# EAGLE design Seilwinde (EAGLE 6.6.0)
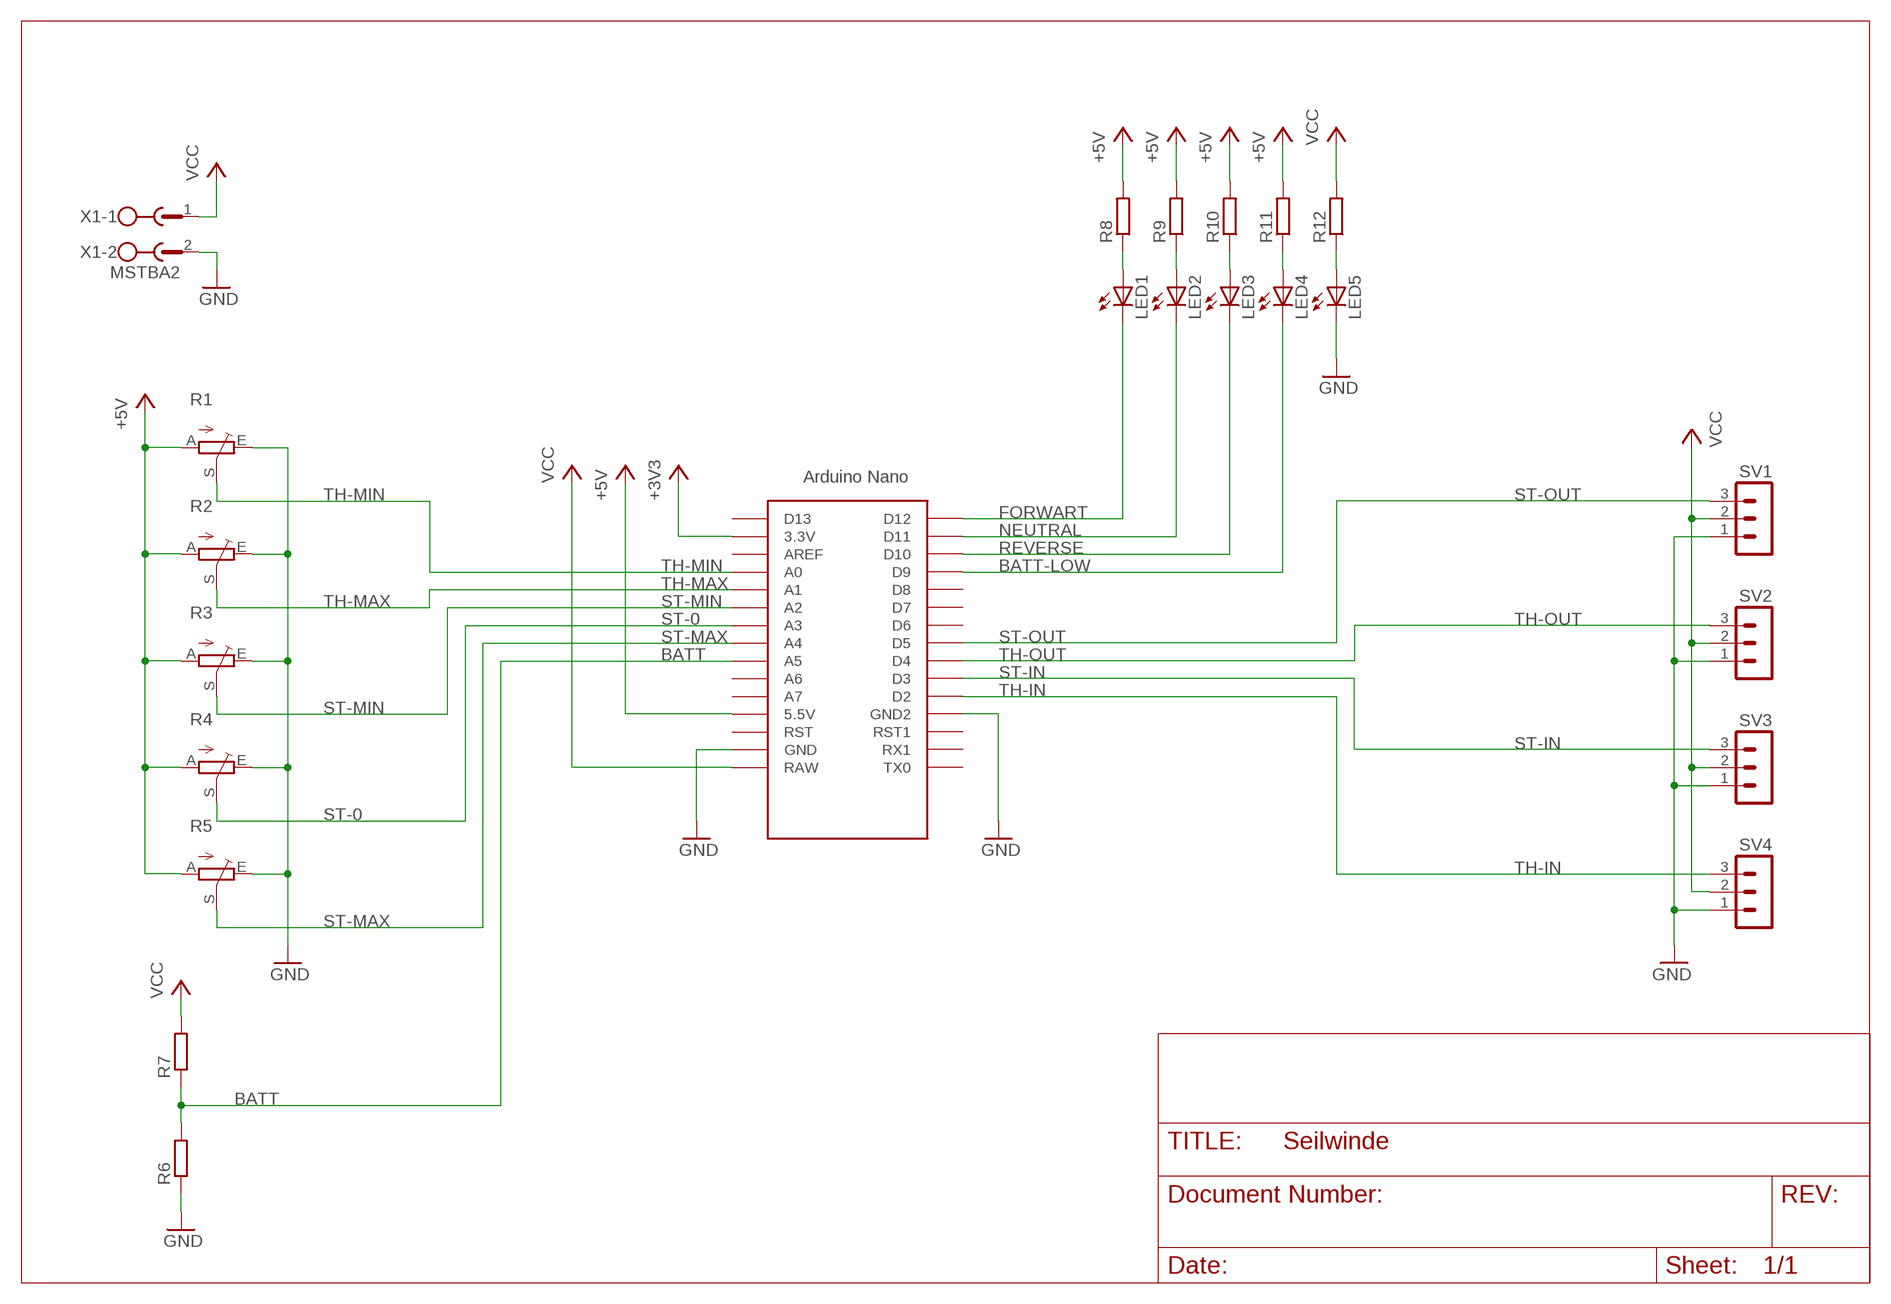
[diagram p0: schematic, sheet 1]

## Parts
LED1  LEDCHIPLED_1206  [CHIPLED_1206]
LED2  LEDCHIPLED_1206  [CHIPLED_1206]
LED3  LEDCHIPLED_1206  [CHIPLED_1206]
LED4  LEDCHIPLED_1206  [CHIPLED_1206]
LED5  LEDCHIPLED_1206  [CHIPLED_1206]
R1  TRIM_EU-S64W  [S64W]
R2  TRIM_EU-S64W  [S64W]
R3  TRIM_EU-S64W  [S64W]
R4  TRIM_EU-S64W  [S64W]
R5  TRIM_EU-S64W  [S64W]
R6  R-EU_R1206  [R1206]
R7  R-EU_R1206  [R1206]
R8  R-EU_R1206  [R1206]
R9  R-EU_R1206  [R1206]
R10  R-EU_R1206  [R1206]
R11  R-EU_R1206  [R1206]
R12  R-EU_R1206  [R1206]
SV1  MA03-1  [MA03-1]
SV2  MA03-1  [MA03-1]
SV3  MA03-1  [MA03-1]
SV4  MA03-1  [MA03-1]
U$1  NANO  [NANO]
X1  MSTBA2  [MSTBA2]

## Nets
+3V3: U$1.3.3V
+5V: R1.A R2.A R3.A R4.A R5.A R8.2 R9.2 R10.2 R11.2 U$1.5V(5.5V)
BATT: R6.2 R7.1 U$1.A5
BATT-LOW: LED4.C U$1.D9
FORWART: LED1.C U$1.D12
GND: LED5.C R1.E R2.E R3.E R4.E R5.E R6.1 SV1.1 SV2.1 SV3.1 SV4.1 U$1.GND U$1.GND1(GND2) X1.2
N$6: LED5.A R12.1
N$12: LED1.A R8.1
N$13: LED2.A R9.1
N$14: LED3.A R10.1
N$15: LED4.A R11.1
NEUTRAL: LED2.C U$1.D11
REVERSE: LED3.C U$1.D10
ST-0: R4.S U$1.A3
ST-IN: SV3.3 U$1.D3
ST-MAX: R5.S U$1.A4
ST-MIN: R3.S U$1.A2
ST-OUT: SV1.3 U$1.D5
TH-IN: SV4.3 U$1.D2
TH-MAX: R2.S U$1.A1
TH-MIN: R1.S U$1.A0
TH-OUT: SV2.3 U$1.D4
VCC: R7.2 R12.2 SV1.2 SV2.2 SV3.2 SV4.2 U$1.RAW X1.1
Unconnected: U$1.A6 U$1.A7 U$1.AREF U$1.D6 U$1.D7 U$1.D8 U$1.D13 U$1.ICSP1 U$1.ICSP2 U$1.ICSP3 U$1.ICSP4 U$1.ICSP5 U$1.ICSP6 U$1.RST U$1.RST1 U$1.RX1 U$1.TX0

## Library data of the parts
LED1-LED5 = led:LED: LED OSRAM: - CHIPLED LG R971, LG N971, LY N971, LG Q971, LY Q971, LO R971, LY R971 LH N974, LH R974 LS Q976, LO Q976, LY Q976 LO Q996 - Hyper CHIPLED LW Q18S LB Q993, LB Q99A, LB R99A - SideLED LS A670, LO A670, LY A670, LG A670, LP A670 LB A673, LV A673, LT A673, LW A673 LH A674 LY A675 LS A676, LA A676, LO A676, LY A676, LW A676 LS A679, LY A679, LG A679 - Hyper Micro SIDELED® LS Y876, LA Y876, LO Y876, LY Y876 LT Y87S - SmartLED LW L88C, LW L88S LB L89C, LB L89S, LG L890 LS L89K, LO L89K, LY L89K LS L896, LA L896, LO L896, LY L896 - TOPLED LS T670, LO T670, LY T670, LG T670, LP T670 LSG T670, LSP T670, LSY T670, LOP T670, LYG T670 LG T671, LOG T671, LSG T671 LB T673, LV T673, LT T673, LW T673 LH T674 LS T676, LA T676, LO T676, LY T676, LB T676, LH T676, LSB T676, LW T676 LB T67C, LV T67C, LT T67C, LS T67K, LO T67K, LY T67K, LW E67C LS E67B, LA E67B, LO E67B, LY E67B, LB E67C, LV E67C, LT E67C LW T67C LS T679, LY T679, LG T679 LS T770, LO T770, LY T770, LG T770, LP T770 LB T773, LV T773, LT T773, LW T773 LH T774 LS E675, LA E675, LY E675, LS T675 LS T776, LA T776, LO T776, LY T776, LB T776 LHGB T686 LT T68C, LB T68C - Hyper Mini TOPLED® LB M676 - Mini TOPLED Santana® LG M470 LS M47K, LO M47K, LY M47K Source: http://www.osram.convergy.de LUXEON: - LUMILED® LXK2-PW12-R00, LXK2-PW12-S00, LXK2-PW14-U00, LXK2-PW14-V00 LXK2-PM12-R00, LXK2-PM12-S00, LXK2-PM14-U00 LXK2-PE12-Q00, LXK2-PE12-R00, LXK2-PE12-S00, LXK2-PE14-T00, LXK2-PE14-U00 LXK2-PB12-K00, LXK2-PB12-L00, LXK2-PB12-M00, LXK2-PB14-N00, LXK2-PB14-P00, LXK2-PB14-Q00 LXK2-PR12-L00, LXK2-PR12-M00, LXK2-PR14-Q00, LXK2-PR14-R00 LXK2-PD12-Q00, LXK2-PD12-R00, LXK2-PD12-S00 LXK2-PH12-R00, LXK2-PH12-S00 LXK2-PL12-P00, LXK2-PL12-Q00, LXK2-PL12-R00 Source: www.luxeon.com KINGBRIGHT: KA-3528ASYC Source: www.kingbright.com
R1-R5 = pot:TRIM_EU-: POTENTIOMETER
R6-R12 = rcl:R-EU_: RESISTOR, European symbol
SV1-SV4 = con-lstb:MA03-1: PIN HEADER; OC_FARNELL: unknown; OC_NEWARK: unknown
U$1 = Arduino-clone:NANO: Arduino Nano
X1 = con-phoenix-508:MSTBA2: PHOENIX; MF: FARNELL; MPN: 1757242; OC_FARNELL: 3705171; OC_NEWARK: 71C4161

## Board
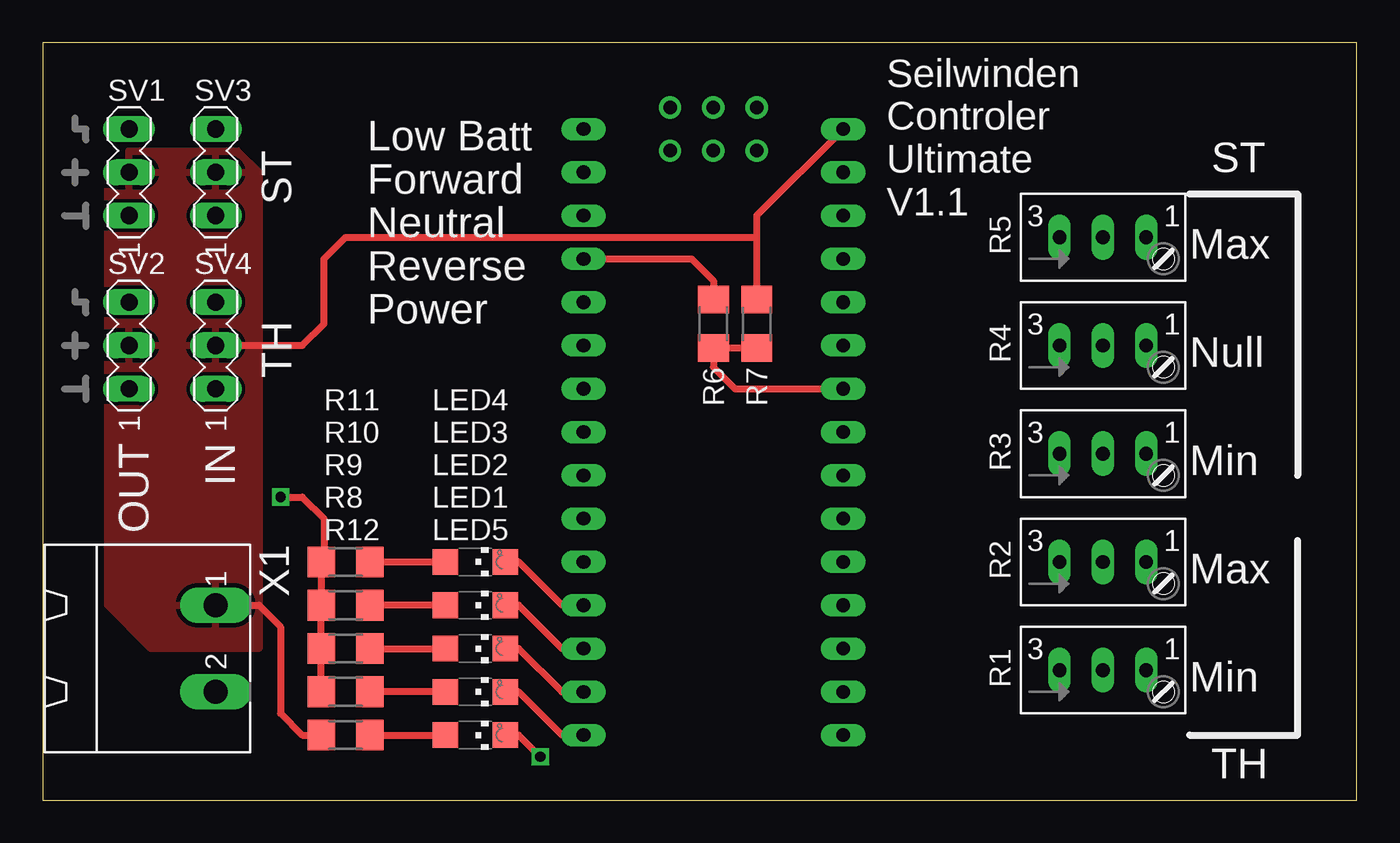
[diagram p1: board, top side]
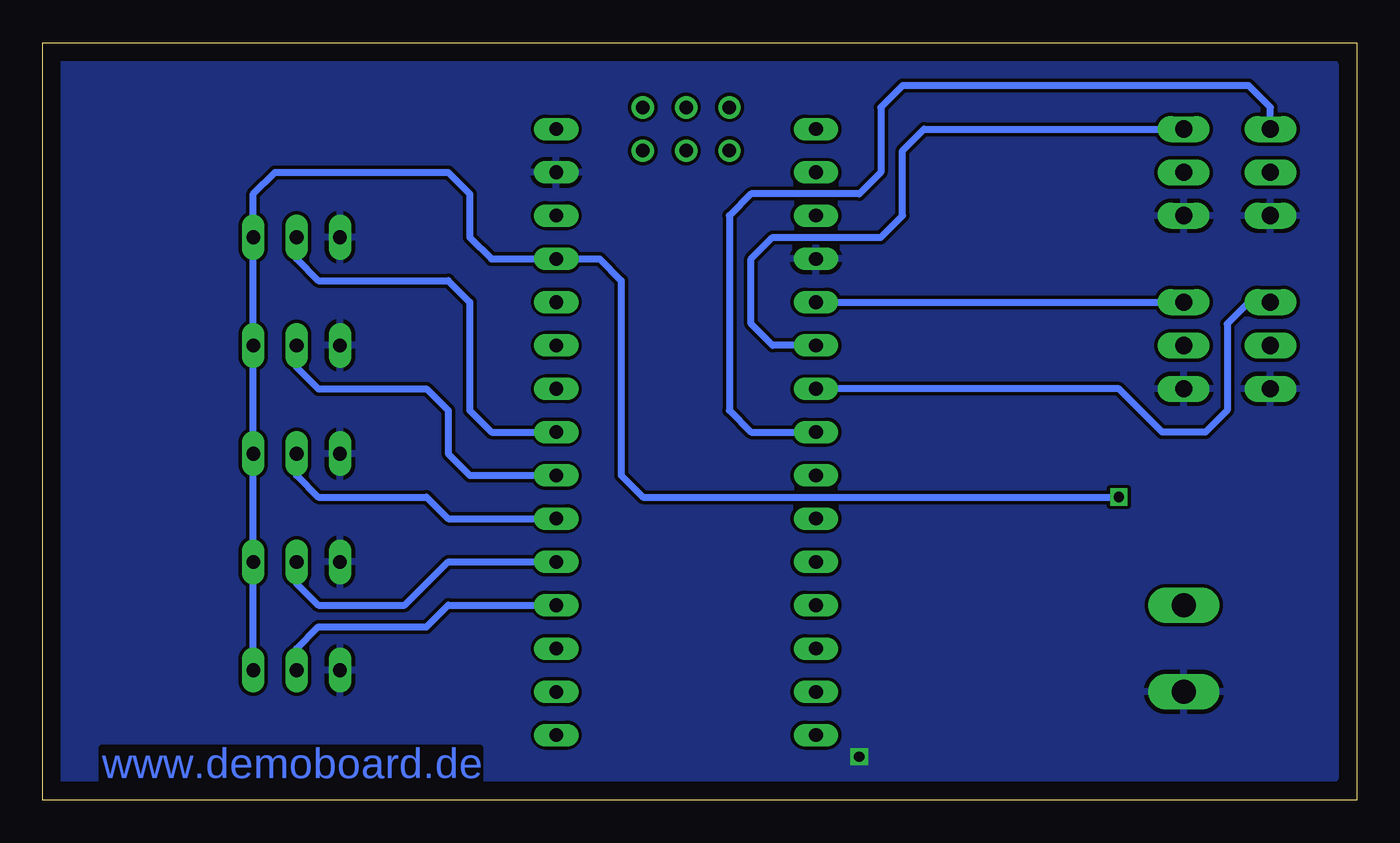
[diagram p2: board, bottom side, seen from below]

Size 77.14 x 44.44 mm. Coordinates in mm from the lower left corner, seen from the top.
Outline: 0,0 77.14,0 77.14,44.44 0,44.44 0,0
Copper layers (1*16): Top 0.035mm / dielectric 1.5mm / Bottom 0.035mm
Design rules "default": minimum track width 10mil, minimum drill 24mil, track to track 8mil, track to pad 8mil, pad to pad 8mil, via to via 8mil, smd to smd 8mil, copper to edge 40mil, drill to drill 8mil, minimum pad ring 10mil, minimum via ring 8mil, stop-mask expansion 4mil, vias tented up to drill 0mil, thermal gap 10mil

### Footprints (pad centres in the part's own frame; a part is rotated, then mirrored left to right if it is on the bottom)
CHIPLED_1206 = smd 1.5 x 1.5: A 0,-1.75; C 0,1.75
S64W = drill 0.813 long: A 2.54,1.27; E -2.54,1.27; S 0,1.27
R1206 = smd 1.6 x 1.803: 1 -1.422,0; 2 1.422,0
MA03-1 = drill 1.016 long: 1 -2.54,0; 2 0,0; 3 2.54,0
NANO = drill 0.8 long: 3.3V -10.16,24.13; 5V -10.16,-1.27; A0 -10.16,19.05; A1 -10.16,16.51; A2 -10.16,13.97; A3 -10.16,11.43; A4 -10.16,8.89; A5 -10.16,6.35; A6 -10.16,3.81; A7 -10.16,1.27; AREF -10.16,21.59; D2 5.08,1.27; D3 5.08,3.81; D4 5.08,6.35; D5 5.08,8.89; D6 5.08,11.43; D7 5.08,13.97; D8 5.08,16.51; D9 5.08,19.05; D10 5.08,21.59; D11 5.08,24.13; D12 5.08,26.67; D13 -10.16,26.67; GND -10.16,-6.35; GND1 5.08,-1.27; RAW -10.16,-8.89; RST -10.16,-3.81; RST1 5.08,-3.81; RX1 5.08,-6.35; TX0 5.08,-8.89 | drill 0.8: ICSP1 -5.08,-10.16; ICSP2 -5.08,-7.62; ICSP3 -2.54,-10.16; ICSP4 -2.54,-7.62; ICSP5 0,-10.16; ICSP6 0,-7.62
MSTBA2 = drill 1.397 long: 1 -2.54,5.08; 2 2.54,5.08

### Placement (x,y rotation side)
LED1  25.4,6.35 270 top
LED2  25.4,8.89 270 top
LED3  25.4,11.43 270 top
LED4  25.4,13.97 270 top
LED5  25.4,3.81 270 top
R1  62.23,6.35 0 top
R2  62.23,12.7 0 top
R3  62.23,19.05 0 top
R4  62.23,25.4 0 top
R5  62.23,31.75 0 top
R6  39.37,27.94 270 top
R7  41.91,27.94 90 top
R8  17.78,6.35 180 top
R9  17.78,8.89 180 top
R10  17.78,11.43 180 top
R11  17.78,13.97 180 top
R12  17.78,3.81 180 top
SV1  5.08,36.83 90 top
SV2  5.08,26.67 90 top
SV3  10.16,36.83 90 top
SV4  10.16,26.67 90 top
U$1  36.83,30.48 180 top
X1  5.08,8.89 270 top

### Tracks (layer width: path | path; a pad name or v marks a point on that pad's centre or on a via)
+5V  (via drill 0.6)
  Top 0.406: v13.97,17.78 15.24,17.78 16.51,16.51 16.51,14.12 R11.2 R10.2 R9.2 R8.2
  Bottom 0.406: R1.A R2.A R3.A R4.A R5.A 64.77,35.56 63.5,36.83 53.34,36.83 52.07,35.56 52.07,33.02 50.8,31.75 U$1.5V 44.45,31.75 43.18,30.48 43.18,19.05 41.91,17.78 v13.97,17.78
BATT
  Top 0.406: U$1.A5 40.64,24.13 39.37,25.4 R6.2 R7.1
BATT-LOW
  Top 0.406: U$1.D9 30.48,11.43 27.94,13.97 LED4.C
FORWART
  Top 0.406: U$1.D12 30.48,3.81 27.94,6.35 LED1.C
GND  (via drill 0.6)
  Top 0.406: U$1.GND1 38.1,31.75 39.37,30.48 R6.1 | LED5.C 27.94,3.81 v29.21,2.54
  pour Bottom: 1.27,1.27 76.2,1.27 76.2,20.32 76.2,43.18 1.27,43.18
N$6
  Top 0.406: R12.1 LED5.A
N$12
  Top 0.406: LED1.A R8.1
N$13
  Top 0.406: R9.1 LED2.A
N$14
  Top 0.406: LED3.A R10.1
N$15
  Top 0.406: R11.1 LED4.A
NEUTRAL
  Top 0.406: U$1.D11 30.48,6.35 27.94,8.89 LED2.C
REVERSE
  Top 0.406: U$1.D10 30.48,8.89 27.94,11.43 LED3.C
ST-0
  Bottom 0.406: R4.S 62.23,25.4 60.96,24.13 54.61,24.13 53.34,22.86 53.34,20.32 52.07,19.05 U$1.A3
ST-IN
  Bottom 0.406: U$1.D3 34.29,26.67 35.56,27.94 35.56,31.75 34.29,33.02 27.94,33.02 26.67,34.29 26.67,38.1 25.4,39.37 SV3.3
ST-MAX
  Bottom 0.406: R5.S 62.23,31.75 60.96,30.48 53.34,30.48 52.07,29.21 52.07,22.86 50.8,21.59 U$1.A4
ST-MIN
  Bottom 0.406: R3.S 62.23,19.05 60.96,17.78 54.61,17.78 53.34,16.51 U$1.A2
ST-OUT
  Bottom 0.406: SV1.3 5.08,40.64 6.35,41.91 26.67,41.91 27.94,40.64 27.94,36.83 29.21,35.56 35.56,35.56 36.83,34.29 36.83,22.86 35.56,21.59 U$1.D5
TH-IN
  Bottom 0.406: U$1.D2 SV4.3
TH-MAX
  Bottom 0.406: R2.S 62.23,12.7 60.96,11.43 55.88,11.43 53.34,13.97 U$1.A1
TH-MIN
  Bottom 0.406: R1.S 62.23,8.89 60.96,10.16 54.61,10.16 53.34,11.43 U$1.A0
TH-OUT
  Bottom 0.406: SV2.3 6.35,29.21 7.62,27.94 7.62,22.86 8.89,21.59 11.43,21.59 13.97,24.13 U$1.D4
VCC
  Top 0.406: X1.1 12.7,11.43 13.97,10.16 13.97,5.08 15.24,3.81 R12.2 | SV4.2 15.24,26.67 16.51,27.94 16.51,31.75 17.78,33.02 41.91,33.02 | 41.91,33.02 R7.2 | U$1.RAW 41.91,34.29 41.91,33.02
  pour Top: 12.7,8.89 6.35,8.89 3.81,11.43 3.81,36.83 5.08,38.1 11.43,38.1 12.7,36.83

### Text on the board
Bottom: www.demoboard.de
tNames: Low Batt | ST | Forward | ST | Seilwinden / Controler / Ultimate / V1.1 | Neutral | Max | Reverse | Power | TH | Null | OUT | IN | Min | Max | Min | TH